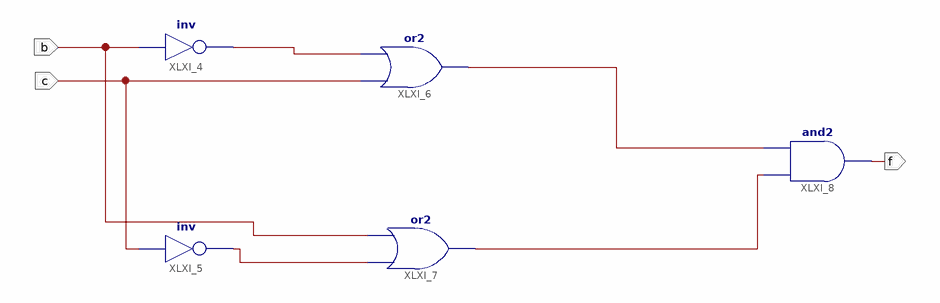
[diagram p0: schematic sheet 1]
// Xilinx ISE schematic schemati.sch (spartan3adsp) as structural Verilog: 5 symbols, 3 ports
module schemati (
  input  c,
  input  b,
  output f
);

  wire XLXN_1, XLXN_4, XLXN_5, XLXN_7;

  not XLXI_4 (XLXN_1, b);
  not XLXI_5 (XLXN_4, c);
  or XLXI_6 (XLXN_5, c, XLXN_1);
  or XLXI_7 (XLXN_7, XLXN_4, b);
  and XLXI_8 (f, XLXN_7, XLXN_5);
endmodule
